# EAGLE design Amp_Measure (EAGLE 8.2.2)
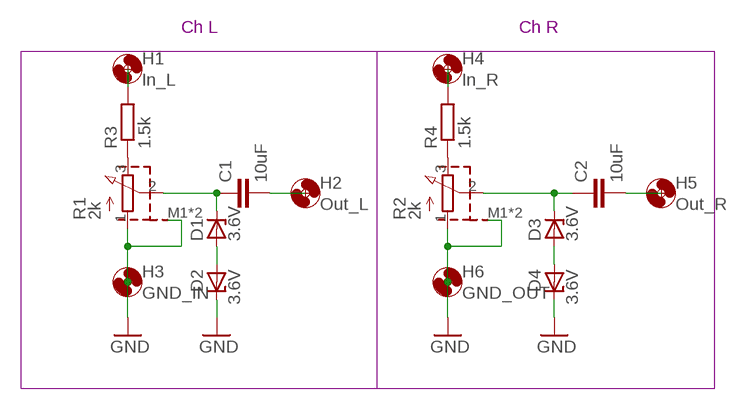
[diagram p0: schematic, sheet 1]

## Parts
C1  10uF  C-EUC0805K  [C0805K]
C2  10uF  C-EUC0805K  [C0805K]
D1  3.6V  ZENER-DIODESOD80C  [SOD80C]
D2  3.6V  ZENER-DIODESOD80C  [SOD80C]
D3  3.6V  ZENER-DIODESOD80C  [SOD80C]
D4  3.6V  ZENER-DIODESOD80C  [SOD80C]
H1  In_L  MOUNT-HOLE3.3  [3,3]
H2  Out_L  MOUNT-HOLE3.3  [3,3]
H3  GND_IN  MOUNT-HOLE3.3  [3,3]
H4  In_R  MOUNT-HOLE3.3  [3,3]
H5  Out_R  MOUNT-HOLE3.3  [3,3]
H6  GND_OUT  MOUNT-HOLE3.3  [3,3]
R1  2k  RS09-N-30  [POTENT]
R2  2k  RS09-N-30  [POTENT]
R3  1.5k  R-EU_R0805W  [R0805W]
R4  1.5k  R-EU_R0805W  [R0805W]

## Nets
GND: D2.C D4.C H3.P$1 H6.P$1 R1.1(A) R1.M1(CASE) R1.M2(CASE) R2.1(A) R2.M1(CASE) R2.M2(CASE)
N$1: R1.3(E) R3.1
N$2: R2.3(E) R4.1
N$3: H1.P$1 R3.2
N$4: C1.1 D1.C R1.2(S)
N$5: D1.A D2.A
N$6: C1.2 H2.P$1
N$7: D3.A D4.A
N$8: H4.P$1 R4.2
N$10: C2.1 D3.C R2.2(S)
N$11: C2.2 H5.P$1

## Notes on the sheet
- Ch L | Ch R

## Library data of the parts
C1 C2 = rcl:C-EU: CAPACITOR, European symbol
D1-D4 = diode:ZENER-DIODE: Z-Diode
H1-H6 = holes:MOUNT-HOLE: MOUNTING HOLE with drill center marker
R1 R2 = usb:RS09-N-30
R3 R4 = rcl:R-EU_: RESISTOR, European symbol

## Board
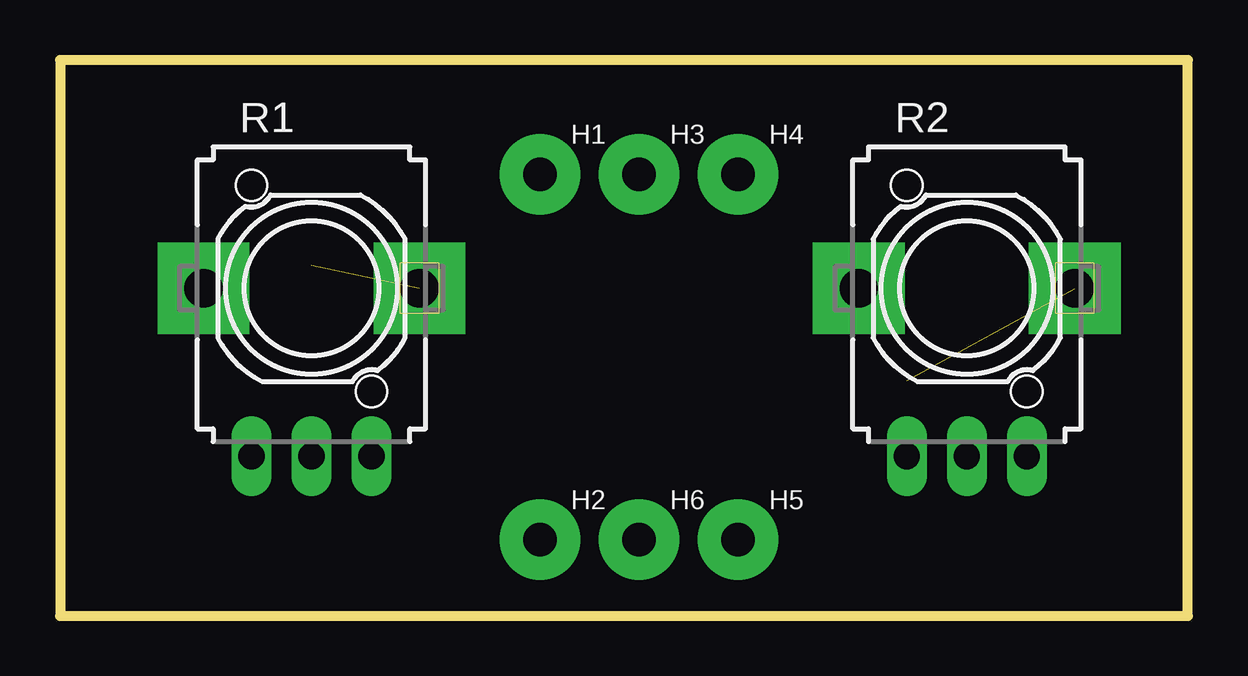
[diagram p1: board, top side]
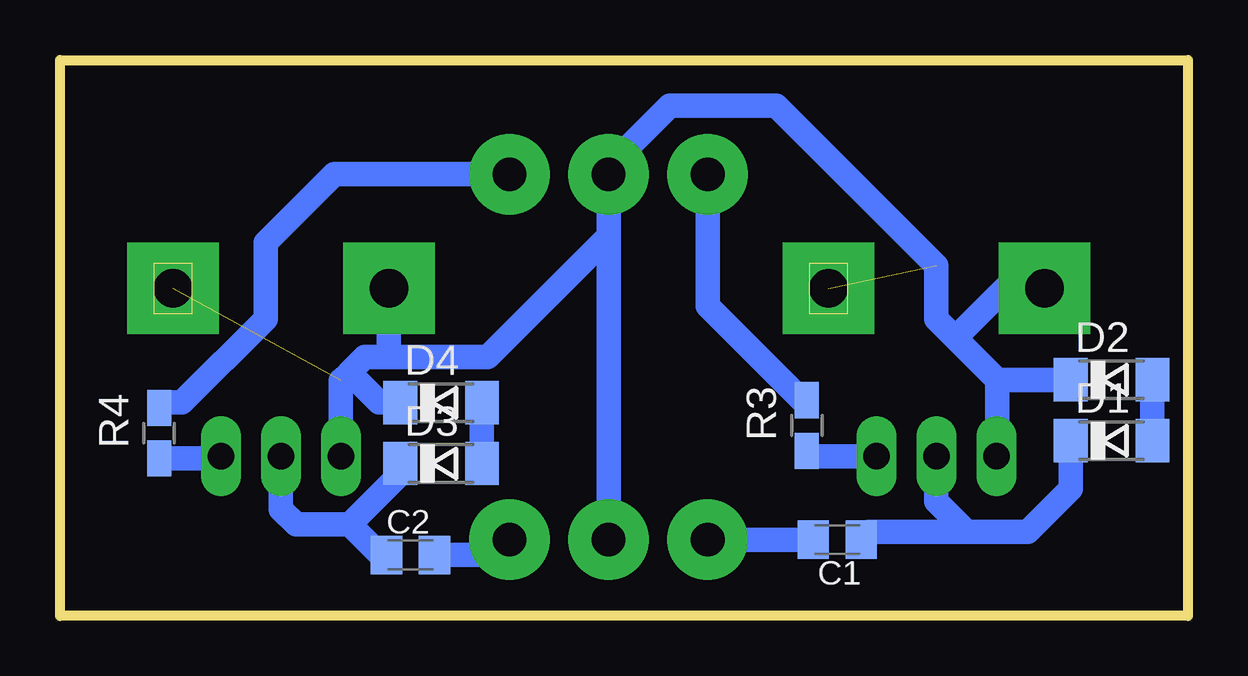
[diagram p2: board, bottom side, seen from below]

Size 46.99 x 23.18 mm. Coordinates in mm from the lower left corner, seen from the top.
Outline: 0,0 46.99,0 46.99,23.18 0,23.18 0,0
Copper layers (1*16): Top 0.035mm / dielectric 1.5mm / Bottom 0.035mm
Design rules "My": minimum track width 16mil, minimum drill 0.35mm, track to track 12mil, track to pad 12mil, pad to pad 12mil, via to via 12mil, smd to smd 12mil, copper to edge 40mil, drill to drill 24mil, minimum pad ring 10mil, minimum via ring 8mil, stop-mask expansion 4mil, vias tented up to drill 0mil, thermal gap 10mil

### Footprints (pad centres in the part's own frame; a part is rotated, then mirrored left to right if it is on the bottom)
C0805K = smd 1.3 x 1.6: 1 -1,0; 2 1,0
SOD80C = smd 1.4 x 1.8: A 1.7,0; C -1.7,0
3,3 = drill 1.4 pad 3.353: P$1 0,0
POTENT = drill 1.1 pad 1.676 long: 1 -2.5,-7; 2 0,-7; 3 2.5,-7 | drill 1.6 pad 3.816 square: M1 4.5,0; M2 -4.5,0
R0805W = smd 1.5 x 1: 1 -1.052,0; 2 1.052,0

### Placement (x,y rotation side)
C1  14.61,3.17 180 bottom
C2  32.38,2.54 0 bottom
D1  3.17,7.3 0 bottom
D2  3.17,9.84 0 bottom
D3  31.11,6.35 0 bottom
D4  31.11,8.89 0 bottom
H1  20,18.41 0 top
H2  20,3.17 0 top
H3  24.13,18.41 0 top
H4  28.26,18.41 0 top
H5  28.26,3.17 0 top
H6  24.13,3.17 0 top
R1  10.48,13.65 0 top
R2  37.78,13.65 0 top
R3  15.88,7.94 90 bottom
R4  42.86,7.62 90 bottom

### Tracks (layer width: path | path; a pad name or v marks a point on that pad's centre or on a via)
GND  (2 unrouted)
  Bottom 1.016: 24.13,15.83 H3.P$1 24.13,18.73 21.59,21.27 17.14,21.27 10.48,14.61 10.48,12.38 9.68,11.59 | 24.13,15.83 H6.P$1 | 9.68,11.59 7.94,9.84 | 7.94,9.84 7.94,6.69 R1.1 | D2.C 7.94,9.84 | R1.M2 7.62,13.65 9.68,11.59 | R2.1 35.28,9.8 34.94,10.15 | 34.94,10.15 34.29,10.79 33.51,10.79 | 33.51,10.79 29.17,10.79 24.13,15.83 | D4.C 33.68,8.89 34.94,10.15 | R2.M2 33.28,11.02 33.51,10.79
N$1
  Bottom 1.016: R1.3 15.64,6.65 R3.1
N$2
  Bottom 1.016: R4.1 40.37,6.57 R2.3
N$3
  Bottom 0.813: 15.97,8.89 R3.2
  Bottom 1.016: H1.P$1 20,12.92 15.97,8.89
N$4
  Bottom 1.016: D1.C 4.88,5.29 6.67,3.49 9.21,3.49 | 9.21,3.49 10.48,4.76 R1.2 | 9.21,3.49 13.29,3.49 C1.1
N$5
  Bottom 1.016: D2.A D1.A
N$6
  Bottom 1.016: C1.2 H2.P$1
N$7
  Bottom 1.016: D3.A D4.A
N$8
  Bottom 1.016: R4.2 42.65,8.89 41.91,8.89 38.42,12.38 38.42,15.56 35.56,18.41 H4.P$1
N$10
  Bottom 1.016: D3.C 32.81,5.92 34.92,3.81 | 34.92,3.81 37.15,3.81 37.78,4.45 R2.2 | C2.1 33.66,2.54 34.92,3.81
N$11
  Bottom 1.016: C2.2 28.89,2.54 H5.P$1